# EAGLE schematic d102-spinsemi-fx (EAGLE 7.5.1)
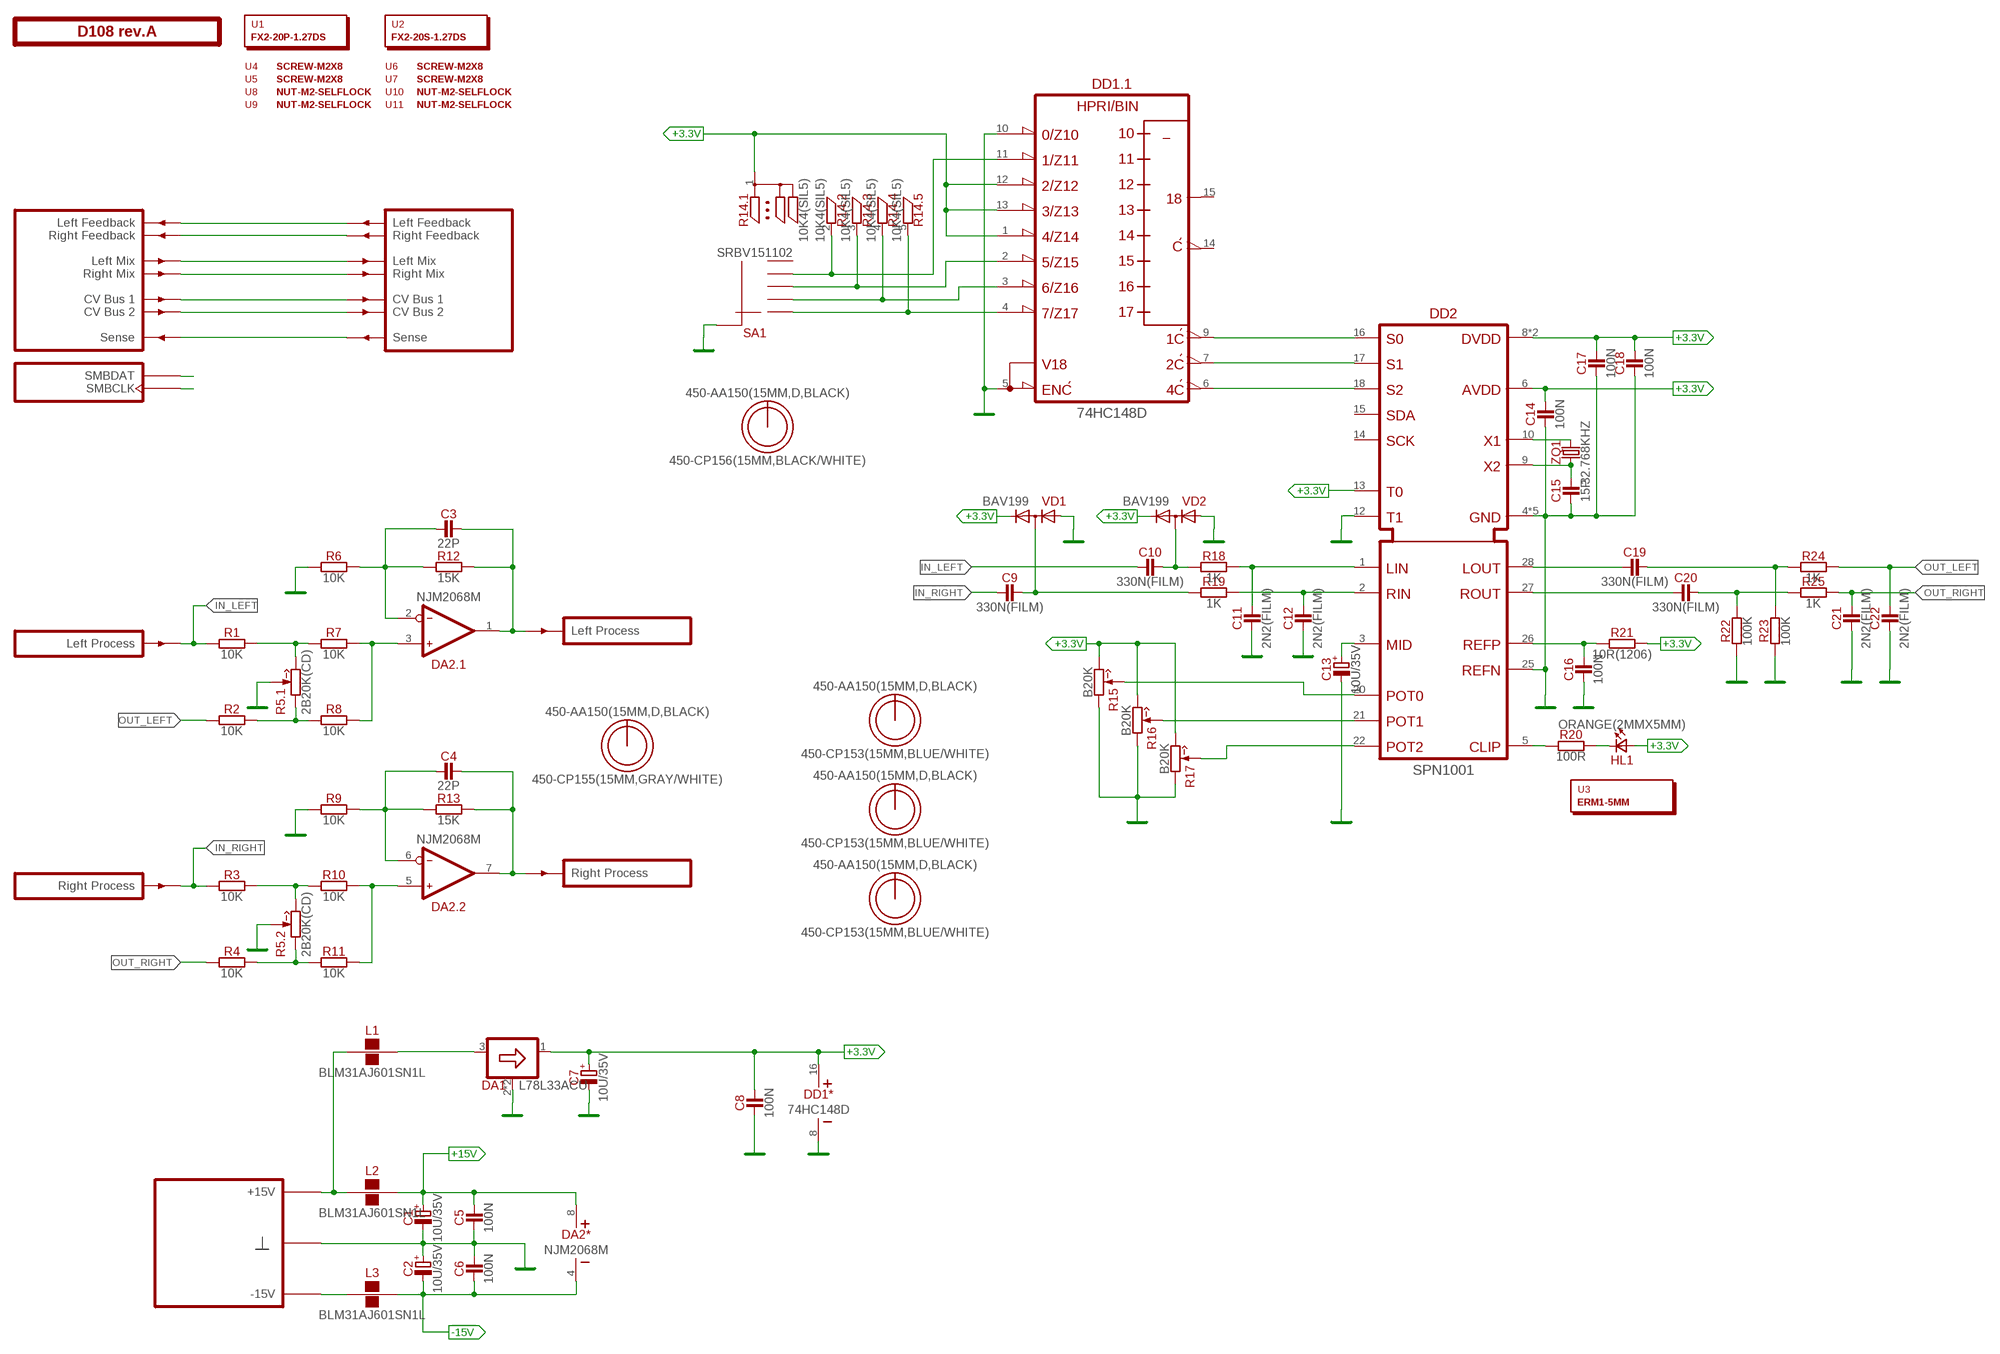
[diagram p0: schematic, sheet 1]

## Parts
C1  10U/35V  [E2-5]
C2  10U/35V  [E2-5]
C3  22P  [C-0805]
C4  22P  [C-0805]
C5  100N  [C-0805]
C6  100N  [C-0805]
C7  10U/35V  [E2-5]
C8  100N  [C-0805]
C9  330N(FILM)  [C050-035X075]
C10  330N(FILM)  [C050-035X075]
C11  2N2(FILM)  [C050-025X075]
C12  2N2(FILM)  [C050-025X075]
C13  10U/35V  [E2-5]
C14  100N  [C-0805]
C15  15P  [C-0805]
C16  100N  [C-0805]
C17  100N  [C-0805]
C18  100N  [C-0805]
C19  330N(FILM)  [C050-035X075]
C20  330N(FILM)  [C050-035X075]
C21  2N2(FILM)  [C050-025X075]
C22  2N2(FILM)  [C050-025X075]
DA1  L78L33ACU  [SOT89]
DA2  NJM2068M  [SO-8]
DD1  74HC148D  [SO-16]
DD2  SPN1001  [SO28W]
HL1  ORANGE(2MMX5MM)  [LED2X5]
L1  BLM31AJ601SN1L  [1206]
L2  BLM31AJ601SN1L  [1206]
L3  BLM31AJ601SN1L  [1206]
O2  450-AA150(15MM,D,BLACK)  [EMPTY]
O3  450-CP155(15MM,GRAY/WHITE)  [EMPTY]
O4  450-AA150(15MM,D,BLACK)  [EMPTY]
O5  450-CP156(15MM,BLACK/WHITE)  [EMPTY]
O6  450-AA150(15MM,D,BLACK)  [EMPTY]
O7  450-CP153(15MM,BLUE/WHITE)  [EMPTY]
O8  450-AA150(15MM,D,BLACK)  [EMPTY]
O9  450-CP153(15MM,BLUE/WHITE)  [EMPTY]
O10  450-AA150(15MM,D,BLACK)  [EMPTY]
O11  450-CP153(15MM,BLUE/WHITE)  [EMPTY]
PCB1  D108 rev.A  ST2-BOARD-50  [ST2-BOARD-50]
R1  10K  [R-0805]
R2  10K  [R-0805]
R3  10K  [R-0805]
R4  10K  [R-0805]
R5  2B20K(CD)  [RV11-DUAL]
R6  10K  [R-0805]
R7  10K  [R-0805]
R8  10K  [R-0805]
R9  10K  [R-0805]
R10  10K  [R-0805]
R11  10K  [R-0805]
R12  15K  [R-0805]
R13  15K  [R-0805]
R14  10K4(SIL5)  [R-SIL5]
R15  B20K  [RV11-SINGLE]
R16  B20K  [RV11-SINGLE]
R17  B20K  [RV11-SINGLE]
R18  1K  [R-0805]
R19  1K  [R-0805]
R20  100R  [R-0805]
R21  10R(1206)  [R-1206]
R22  100K  [R-0805]
R23  100K  [R-0805]
R24  1K  [R-0805]
R25  1K  [R-0805]
SA1  SRBV151102  [SRBV]
U1  FX2-20P-1.27DS  [EMPTY]
U2  FX2-20S-1.27DS  [EMPTY]
U3  ERM1-5MM  [EMPTY]
U4  SCREW-M2X8  [EMPTY]
U5  SCREW-M2X8  [EMPTY]
U6  SCREW-M2X8  [EMPTY]
U7  SCREW-M2X8  [EMPTY]
U8  NUT-M2-SELFLOCK  [EMPTY]
U9  NUT-M2-SELFLOCK  [EMPTY]
U10  NUT-M2-SELFLOCK  [EMPTY]
U11  NUT-M2-SELFLOCK  [EMPTY]
VD1  BAV199  [SOT23]
VD2  BAV199  [SOT23]
ZQ1  32.768KHZ  [3215]

## Nets
+3.3V: C7.+ C8.2 C14.2 C17.2 C18.2 DA1.1(OUT) DD1.1 DD1.12 DD1.13 DD1.16(*:V+) DD2.6(AVDD) DD2.8(DVDD) DD2.13(T0) DD2.23(DVDD) HL1.A R14.1 R15.3(CW) R16.3(CW) R17.3(CW) R21.2 VD1.2(C) VD2.2(C)
+15V [power]: C1.+ C5.2 DA2.8(*:V+) L2.2
-15V [power]: C2.- C6.1 DA2.4(*:V-) L3.2
GND: C1.- C2.+ C5.1 C6.2 C7.- C8.1 C11.1 C12.1 C13.- C14.1 C15.1 C16.1 C17.1 C18.1 C21.1 C22.1 DA1.2(GND) DA1.2@1(GND) DD1.5(.1:EI) DD1.8(*:V-) DD1.10 DD2.4(GND) DD2.7(GND) DD2.11(GND) DD2.12(T1) DD2.19(GND) DD2.24(GND) DD2.25(REFN) PCB1.B4'(GND) PCB1.B4(GND) PCB1.B5'(GND) PCB1.B5(GND) PCB1.B6'(GND) PCB1.B6(GND) PCB1.B7'(GND) PCB1.B7(GND) PCB1.B8'(GND) PCB1.B8(GND) R5.2'(.2:W) R5.2(.1:W) R6.1 R9.1 R15.1(CCW) R16.1(CCW) R17.1(CCW) R22.1 R23.1 SA1.1(CM) SA1.10(CM) VD1.1(A) VD2.1(A)
IN_LEFT: C10.1 PCB1.BINL(INL) R1.1
IN_RIGHT: C9.1 PCB1.BINR(INR) R3.1
LMIX: PCB1.ALMIX'(LMIX') PCB1.ALMIX(LMIX)
N$1: PCB1.ALFBK'(LFBK') PCB1.ALFBK(LFBK)
N$2: PCB1.ARFBK'(RFBK') PCB1.ARFBK(RFBK)
N$3: C3.2 DA2.1(.1:OUT) PCB1.BOUTL'(OUTL) R12.2
N$4: C4.2 DA2.7(.2:OUT) PCB1.BOUTR'(OUTR) R13.2
N$5: DD1.4 R14.5 SA1.2
N$6: DD1.3 R14.4 SA1.3
N$7: R3.2 R5.3'(.2:CW) R10.1
N$8: DD1.2 R14.3 SA1.4
N$9: DD1.11 R14.2 SA1.5
N$10: DD1.9(.1:A0) DD2.16(S0)
N$11: DD2.10(X1) ZQ1.2
N$12: DD1.7(.1:A1) DD2.17(S1)
N$13: DD1.6(.1:A2) DD2.18(S2)
N$14: HL1.K(C) R20.2
N$15: DD2.5(CLIP) R20.1
N$16: PCB1.BSENSE'(SENSE') PCB1.BSENSE(SENSE)
N$17: C12.2 DD2.2(RIN) R19.2
N$18: DD2.22(POT2) R17.2(W)
N$19: DD2.21(POT1) R16.2(W)
N$20: DD2.20(POT0) R15.2(W)
N$21: C16.2 DD2.26(REFP) R21.1
N$22: C13.+ DD2.3(MID)
N$23: C11.2 DD2.1(LIN) R18.2
N$24: C10.2 R18.1 VD2.3(CMN)
N$25: C4.1 DA2.6(.2:IN-) R9.2 R13.1
N$26: C9.2 R19.1 VD1.3(CMN)
N$27: C19.1 DD2.28(LOUT)
N$28: C15.2 DD2.9(X2) ZQ1.1
N$29: C20.1 DD2.27(ROUT)
N$30: R1.2 R5.3(.1:CW) R7.1
N$31: C20.2 R22.2 R25.1
N$32: C19.2 R23.2 R24.1
N$36: L3.1 PCB1.A-15'(P-15V) PCB1.A-15(P-15V) PCB1.B-15'(P-15V) PCB1.B-15(P-15V)
N$38: PCB1.ASMBDAT'(SMBDAT) PCB1.ASMBDAT(SMBDAT)
N$39: DA2.5(.2:IN+) R10.2 R11.2
N$40: R4.2 R5.1'(.2:CCW) R11.1
N$41: PCB1.ACV1'(CV1') PCB1.ACV1(CV1)
N$42: PCB1.ACV2'(CV2') PCB1.ACV2(CV2)
N$43: PCB1.ASMBCLK'(SMBCLK) PCB1.ASMBCLK(SMBCLK)
N$44: DA1.3(IN) L1.2
N$61: DA2.3(.1:IN+) R7.2 R8.2
N$64: C3.1 DA2.2(.1:IN-) R6.2 R12.1
N$65: R2.2 R5.1(.1:CCW) R8.1
OUT_LEFT: C22.2 R2.1 R24.2
OUT_RIGHT: C21.2 R4.1 R25.2
P+15V: L1.1 L2.1 PCB1.A+15'(P+15V) PCB1.A+15(P+15V) PCB1.B+15'(P+15V) PCB1.B+15(P+15V)
RMIX: PCB1.ARMIX'(RMIX') PCB1.ARMIX(RMIX)
Unconnected: DD1.14(.1:GS) DD1.15(.1:EO) DD2.14(SCK) DD2.15(SDA) SA1.6

## Library data of the parts
C1 C2 C7 C13 = capacitors-electrolytic:?; MOUSER: 647-USW1V100MDD
C3 C4 = capacitors:?; MOUSER: 77-VJ0805A220GXACBC
C5 C6 C8 C14 C16-C18 = capacitors:?; MOUSER: 77-VJ0805V104MXBPBC
C9 C10 C19 C20 = capacitors:?; MOUSER: 505-MKS2.33/63/10
C11 C12 C21 C22 = capacitors:?; MOUSER: 80-PHE426DJ4220JR05
C15 = capacitors:?; MOUSER: 77-VJ0805A150GXAPBC
DA1 = regulators-linear:?; MOUSER: 511-L78L33ACU
DA2 = ic-jrc:NJM2068; MOUSER: 513-NJM2068M
DD1 = ic-logic:74*148?
DD2 = ic-spin:SPN1001
HL1 = optoelectronics:?(2MMX5MM)
L1-L3 = inductors:BLM31AJ601SN1L; MOUSER: 81-BLM31AJ601SN1L
O2 O4 O6 O8 O10 = hardware:450-AA?; MOUSER: 450-AA150
O3 = hardware:450-C?; MOUSER: 450-CP155
O5 = hardware:450-C?; MOUSER: 450-CP156
O7 O9 O11 = hardware:450-C?; MOUSER: 450-CP153
PCB1 = module-footprints:ST2-BOARD-?
R1-R4 R6-R11 = resistors:?; MOUSER: 660-RK73H2ATTD1002F
R5 = potentiometers:2**?; MOUSER: 688-RK12L1230C1M
R12 R13 = resistors:?; MOUSER: 660-RK73H2ATTD1502F
R14 = resistors:?**4(SIL5); MOUSER: 858-L051S103LF
R15-R17 = potentiometers:?; MOUSER: 688-RK11K113002F; MOUSER_: 858-P110KH0F25BR20K
R18 R19 R24 R25 = resistors:?; MOUSER: 660-RK73H2ATTD1001F
R20 = resistors:?; MOUSER: 660-RK73H2ATTD1000F
R21 = resistors:?; MOUSER: 660-RK73H2BTTD10R0F
R22 R23 = resistors:?; MOUSER: 660-RK73H2ATTD1003F
SA1 = switches:SRBV151102; MOUSER: 688-SRBV151102
U1 = hardware:?; MOUSER: 798-FX2-20P-1.27DS71
U2 = hardware:?; MOUSER: 798-FX2-20S-1.27DS71
U3 = hardware:?
U4-U11 = hardware:*?
VD1 VD2 = diodes:BAV199; MOUSER: 771-BAV199-T/R
ZQ1 = frequency:?